# Altium project Bi_Directional_DC_DC.PrjPcb
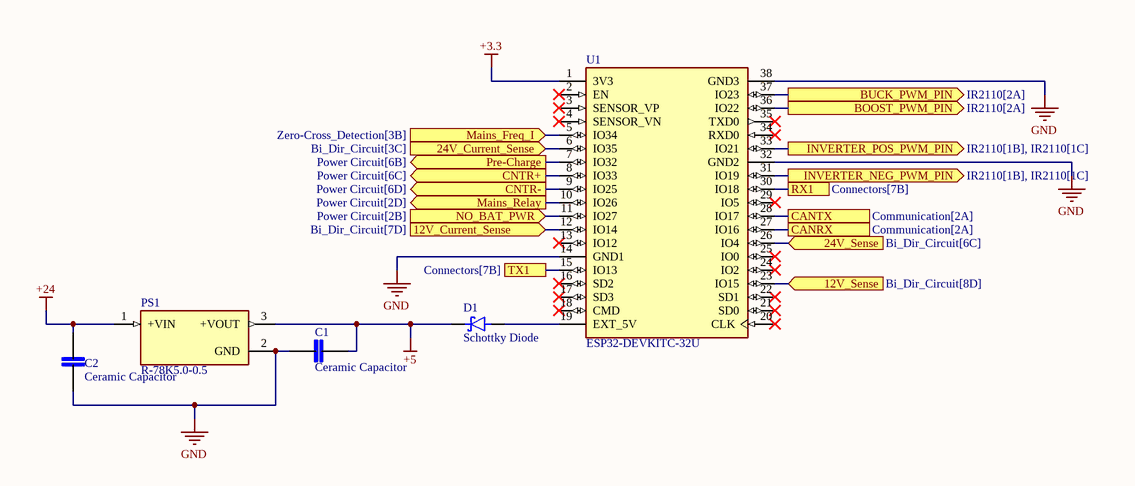
[diagram p0: ESP32.SchDoc]
7 sheets, 172 parts. Net scope: flat (ports and power ports of the same name join across sheets).
Board files: Bi_Dir.PcbDoc, Battery_Converter.PcbDoc
Sheets:
  ESP32.SchDoc
  IR2110.SchDoc
  Bi_Dir_Circuit.SchDoc
  Power Circuit.SchDoc
  Communication.SchDoc
  Zero-Cross_Detection.SchDoc
  Connectors.SchDoc

## Sheet ESP32.SchDoc
size 381 x 241 mm; SheetNumber: 1; SheetTotal: 7

### Parts
C1  Ceramic Capacitor  [Ceramic Capacitor]
C2  Ceramic Capacitor  [Ceramic Capacitor]
D1  Schottky Diode  [Common Trhough Hole]
PS1  R-78K5.0-0.5  [CONV_R-78K5.0-0.5]
U1  ESP32-DEVKITC-32U  [MODULE_ESP32-DEVKITC-32U]

### Ports
12V_Current_Sense (in, see Bi_Dir_Circuit[7D]), 12V_Sense (in, see Bi_Dir_Circuit[8D]), 24V_Current_Sense (in, see Bi_Dir_Circuit[3C]), 24V_Sense (in, see Bi_Dir_Circuit[6C]), BOOST_PWM_PIN (out, see IR2110[2A]), BUCK_PWM_PIN (out, see IR2110[2A]), CANRX (see Communication[2A]), CANTX (see Communication[2A]), CNTR+ (out, see Power Circuit[6C]), CNTR- (out, see Power Circuit[6D]), INVERTER_NEG_PWM_PIN (out, see IR2110[1B], IR2110[1C]), INVERTER_POS_PWM_PIN (out, see IR2110[1B], IR2110[1C]), Mains_Freq_I (in, see Zero-Cross_Detection[3B]), Mains_Relay (out, see Power Circuit[2D]), NO_BAT_PWR (in, see Power Circuit[2B]), Pre-Charge (out, see Power Circuit[6B]), RX1 (see Connectors[7B]), TX1 (see Connectors[7B])

### Nets
+3.3: U1.1(3V3)
+5: C1.2 D1.1(K) PS1.3(+VOUT)
+24: C2.2 PS1.1(+VIN)
GND: C1.1 C2.1 PS1.2(GND) U1.14(GND1) U1.32(GND2) U1.38(GND3)
NetC18_P: U1.26(IO4) ; port 24V_Sense
NetC20_P: U1.6(IO35) ; port 24V_Current_Sense
NetC24_P: U1.23(IO15) ; port 12V_Sense
NetC25_P: U1.12(IO14) ; port 12V_Current_Sense
NetD1_2: D1.2(A) U1.19(EXT_5V)
NetJ6_2: U1.30(IO18) ; port RX1
NetJ6_3: U1.15(IO13) ; port TX1
NetR35_2: U1.7(IO32) ; port Pre-Charge
NetR37_2: U1.11(IO27) ; port NO_BAT_PWR
NetR40_2: U1.8(IO33) ; port CNTR+
NetR42_2: U1.10(IO26) ; port Mains_Relay
NetR43_2: U1.9(IO25) ; port CNTR-
NetR46_1: U1.5(IO34) ; port Mains_Freq_I
NetU1_27: U1.27(IO16) ; port CANRX
NetU1_28: U1.28(IO17) ; port CANTX
NetU1_31: U1.31(IO19) ; port INVERTER_NEG_PWM_PIN
NetU1_33: U1.33(IO21) ; port INVERTER_POS_PWM_PIN
NetU1_36: U1.36(IO22) ; port BOOST_PWM_PIN
NetU1_37: U1.37(IO23) ; port BUCK_PWM_PIN

Not connected (* = marked no-connect by the designer): U1 2(EN)* 3(SENSOR_VP)* 4(SENSOR_VN)* 13(IO12)* 16(SD2)* 17(SD3)* 18(CMD)* 20(CLK)* 21(SD0)* 22(SD1)* 24(IO2)* 25(IO0)* 29(IO5)* 34(RXD0)* 35(TXD0)*

### Library data of the parts
C1 C2 = Ceramic Capacitor: MP: LD051A121KAB2A; MF: AVX; SnapEDA_Link: https://www.snapeda.com/parts/LD051A121KAB2A/AVX/view-part/?ref=snap; Package: 0805 AVX; Check_prices: https://www.snapeda.com/parts/LD051A121KAB2A/AVX/view-part/?ref=eda; Purchase-URL: https://pricing.snapeda.com/search/part/LD051A121KAB2A/?ref=eda; Price: None; Value: *; Availability: In Stock
D1 = Schottky Diode: MF: Diodes Inc.; MP: 1N5817-T; Package: DO-41 Diodes Inc.; Price: None; Check_prices: https://www.snapeda.com/parts/1N5817-T/Diodes+Inc./view-part/?ref=eda; Value: *; SnapEDA_Link: https://www.snapeda.com/parts/1N5817-T/Diodes+Inc./view-part/?ref=snap; Availability: In Stock; Purchase-URL: https://pricing.snapeda.com/search/part/1N5817-T/?ref=eda
PS1 = R-78K5.0-0.5: 0.5A DC/DC-Converter 'INNOLINE' SIP3 reg; MF: Recom Power; Package: None; Value: *; Check_prices: https://www.snapeda.com/parts/R-78K5.0-0.5/Recom+Power/view-part/?ref=eda; Purchase-URL: https://pricing.snapeda.com/search/part/R-78K5.0-0.5/?ref=eda; Availability: In Stock; SnapEDA_Link: https://www.snapeda.com/parts/R-78K5.0-0.5/Recom+Power/view-part/?ref=snap; Price: None; MP: R-78K5.0-0.5
U1 = ESP32-DEVKITC-32U: ESP32-WROOM-32UE series Transceiver; 802.11 b/g/n (Wi-Fi, WiFi, WLAN), BluetoothÂ® Smart Ready 4.x Dual Mode Evaluation Board; MF: Espressif Systems; SnapEDA_Link: https://www.snapeda.com/parts/ESP32-DEVKITC-32U/Espressif+Systems/view-part/?ref=snap; Availability: In Stock; Purchase-URL: https://pricing.snapeda.com/search/part/ESP32-DEVKITC-32U/?ref=eda; Check_prices: https://www.snapeda.com/parts/ESP32-DEVKITC-32U/Espressif+Systems/view-part/?ref=eda; Value: *; Package: None; MP: ESP32-DEVKITC-32U; Price: None

## Sheet IR2110.SchDoc
size A3; SheetNumber: 2; SheetTotal: 7
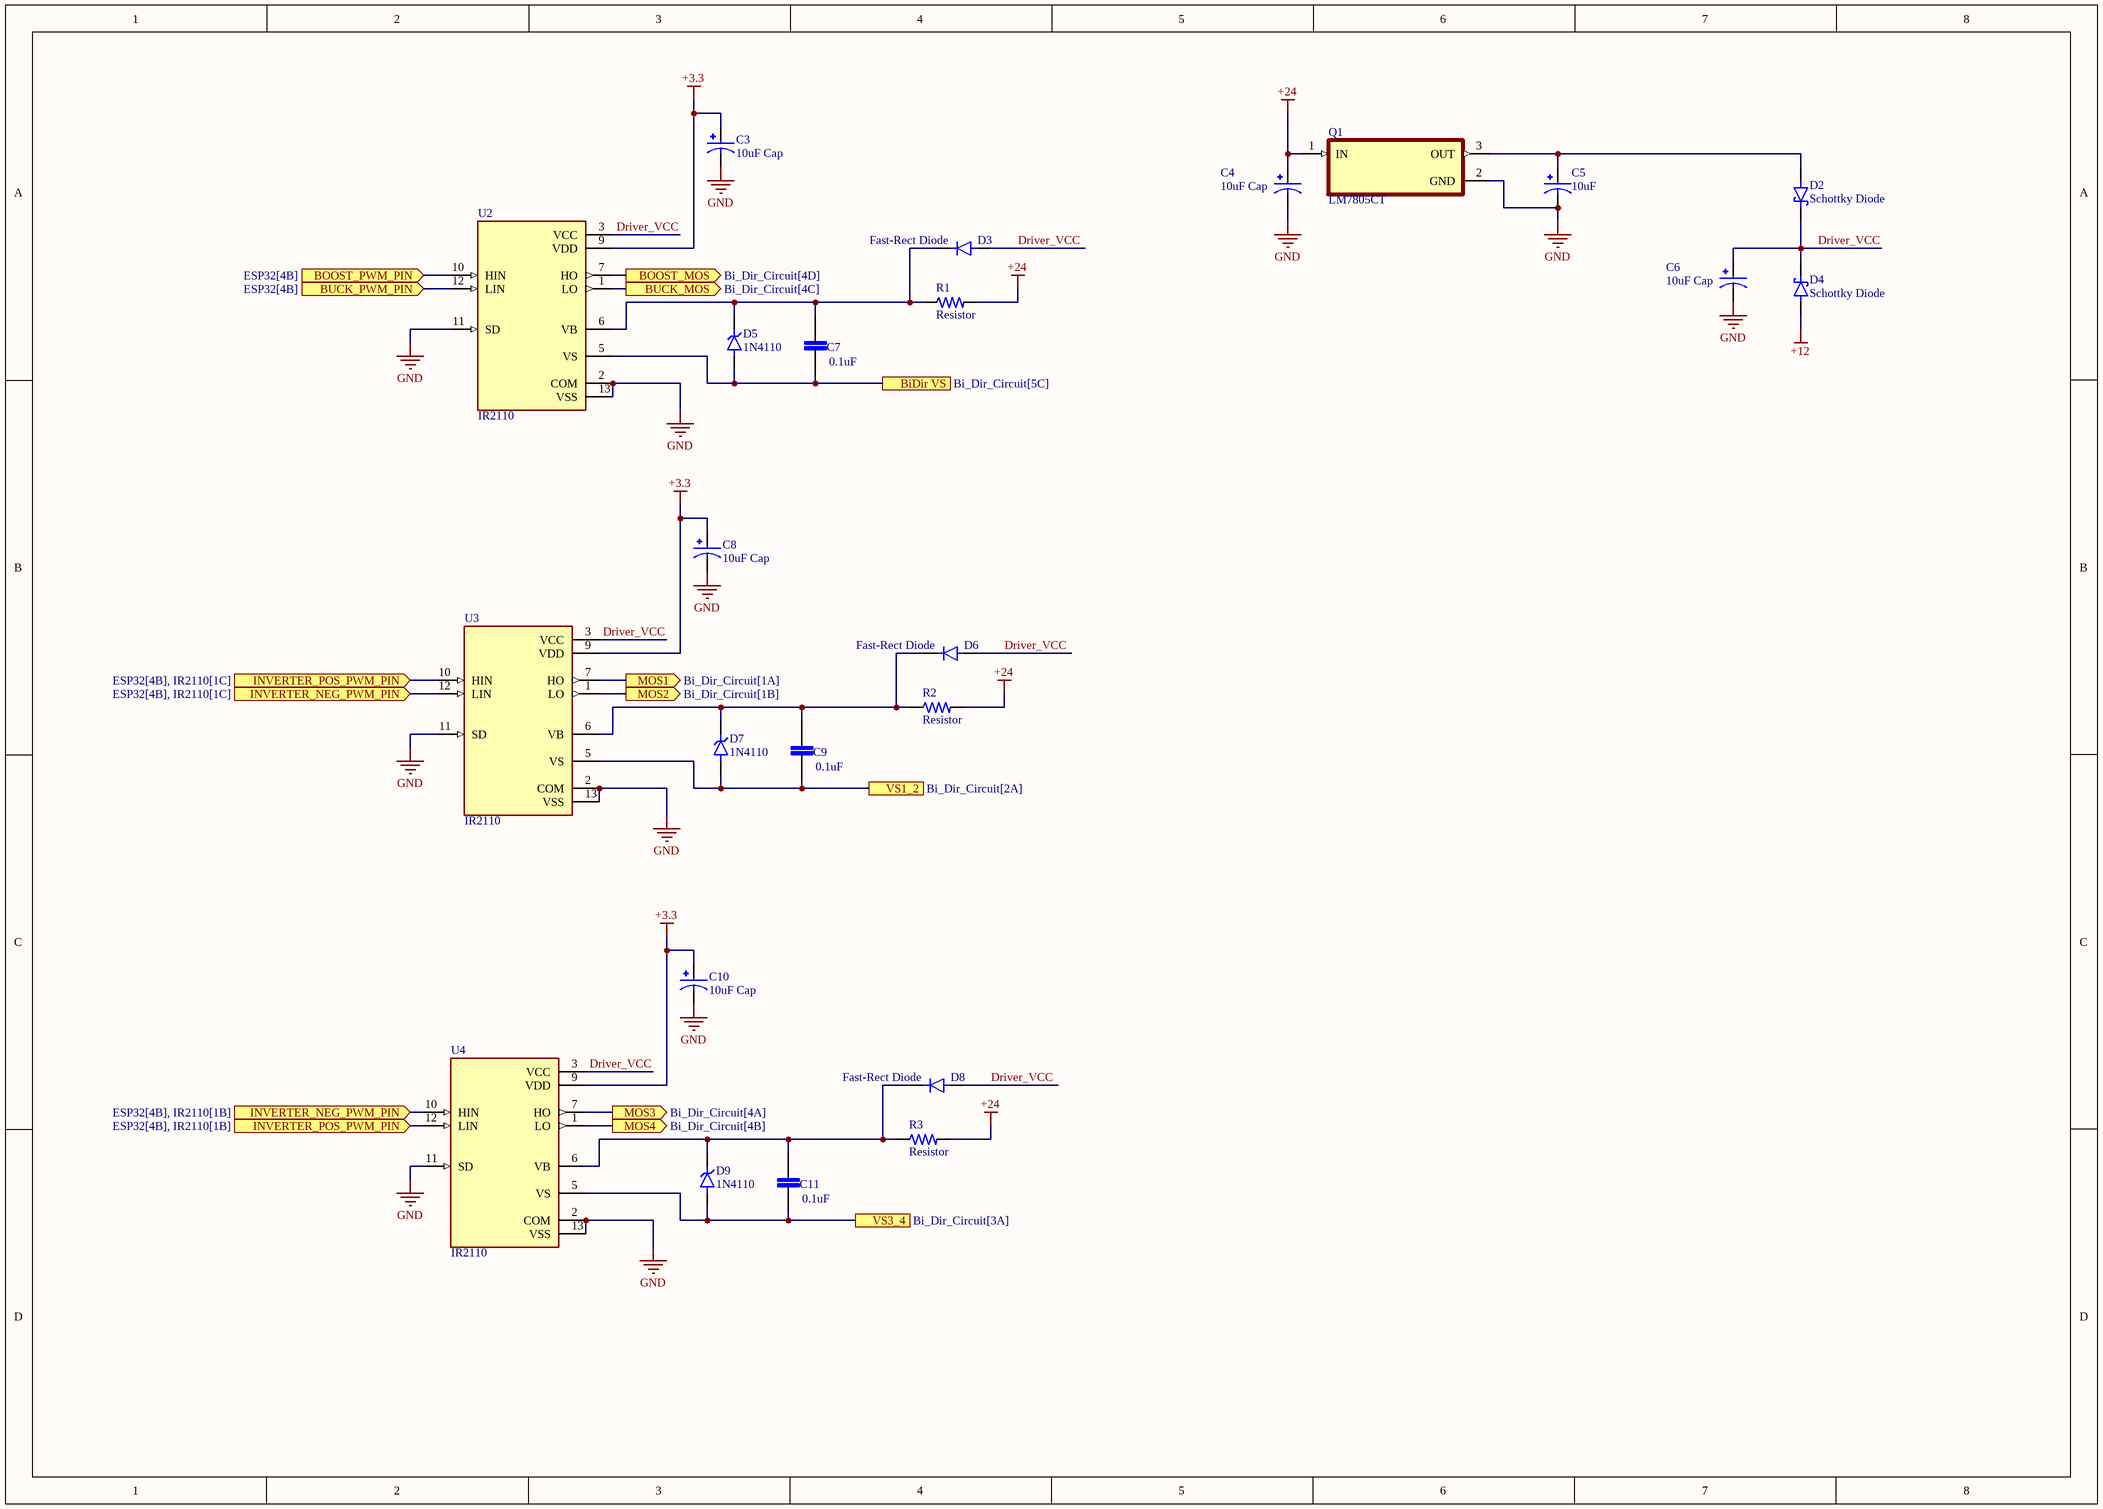
[diagram p1: IR2110.SchDoc]

### Parts
C3  10uF Cap  [CAP_10uF]
C4  10uF Cap  [CAP_10uF]
C5  10uF  [CAP_10uF]
C6  10uF Cap  [CAP_10uF]
C7  0.1uF  [Ceramic Capacitor]
C8  10uF Cap  [CAP_10uF]
C9  0.1uF  [Ceramic Capacitor]
C10  10uF Cap  [CAP_10uF]
C11  0.1uF  [Ceramic Capacitor]
D2  Schottky Diode  [Common Trhough Hole]
D3  Fast-Rect Diode  [Common Trhough Hole]
D4  Schottky Diode  [Common Trhough Hole]
D5  1N4110  [Common Trhough Hole]
D6  Fast-Rect Diode  [Common Trhough Hole]
D7  1N4110  [Common Trhough Hole]
D8  Fast-Rect Diode  [Common Trhough Hole]
D9  1N4110  [Common Trhough Hole]
Q1  LM7805CT  [LM7805CT]
R1  Resistor  [Resistor_Through Hole]
R2  Resistor  [Resistor_Through Hole]
R3  Resistor  [Resistor_Through Hole]
U2  IR2110  [IR2110]
U3  IR2110  [IR2110]
U4  IR2110  [IR2110]

### Ports
BiDir VS (see Bi_Dir_Circuit[5C]), BOOST_MOS (out, see Bi_Dir_Circuit[4D]), BOOST_PWM_PIN (in, see ESP32[4B]), BUCK_MOS (out, see Bi_Dir_Circuit[4C]), BUCK_PWM_PIN (in, see ESP32[4B]), INVERTER_NEG_PWM_PIN (in, see ESP32[4B], IR2110[1B]), INVERTER_NEG_PWM_PIN (in, see ESP32[4B], IR2110[1C]), INVERTER_POS_PWM_PIN (in, see ESP32[4B], IR2110[1B]), INVERTER_POS_PWM_PIN (in, see ESP32[4B], IR2110[1C]), MOS1 (out, see Bi_Dir_Circuit[1A]), MOS2 (out, see Bi_Dir_Circuit[1B]), MOS3 (out, see Bi_Dir_Circuit[4A]), MOS4 (out, see Bi_Dir_Circuit[4B]), VS1_2 (see Bi_Dir_Circuit[2A]), VS3_4 (see Bi_Dir_Circuit[3A])

### Nets
+3.3: C3.P C8.P C10.P U2.9(VDD) U3.9(VDD) U4.9(VDD)
+12: D4.2(A)
+24: C4.P Q1.1(IN) R1.2 R2.2 R3.2
GND: C3.N C4.N C5.N C6.N C8.N C10.N Q1.2(GND) U2.2(COM) U2.11(SD) U2.13(VSS) U3.2(COM) U3.11(SD) U3.13(VSS) U4.2(COM) U4.11(SD) U4.13(VSS)
Driver_VCC: C6.P D2.1(K) D3.2(A) D4.1(K) D6.2(A) D8.2(A) U2.3(VCC) U3.3(VCC) U4.3(VCC)
NetC5_P: C5.P D2.2(A) Q1.3(OUT)
NetC7_1: C7.1 D5.2(A) U2.5(VS) ; port BiDir VS
NetC7_2: C7.2 D3.1(K) D5.1(K) R1.1 U2.6(VB)
NetC9_1: C9.1 D7.2(A) U3.5(VS) ; port VS1_2
NetC9_2: C9.2 D6.1(K) D7.1(K) R2.1 U3.6(VB)
NetC11_1: C11.1 D9.2(A) U4.5(VS) ; port VS3_4
NetC11_2: C11.2 D8.1(K) D9.1(K) R3.1 U4.6(VB)
NetD14_C: U3.7(HO) ; port MOS1
NetD15_C: U4.7(HO) ; port MOS3
NetD17_C: U3.1(LO) ; port MOS2
NetD18_C: U4.1(LO) ; port MOS4
NetD24_C: U2.1(LO) ; port BUCK_MOS
NetD25_C: U2.7(HO) ; port BOOST_MOS
NetU1_31: U3.12(LIN) U4.10(HIN) ; port INVERTER_NEG_PWM_PIN
NetU1_33: U3.10(HIN) U4.12(LIN) ; port INVERTER_POS_PWM_PIN
NetU1_36: U2.10(HIN) ; port BOOST_PWM_PIN
NetU1_37: U2.12(LIN) ; port BUCK_PWM_PIN

### Library data of the parts
C3-C6 C8 C10 = 10uF Cap: CAP ALUM 10UF 20% 50V RADIAL; MP: ECE-A1HN100UI; MF: Panasonic; SnapEDA_Link: https://www.snapeda.com/parts/ECE-A1HN100UI/Panasonic/view-part/2321690/?ref=snap; Price: None; Check_prices: https://www.snapeda.com/parts/ECE-A1HN100UI/Panasonic/view-part/2321690/?ref=eda; Value: *; Availability: In Stock; Package: RADIAL-2 Panasonic
C7 C9 C11 = Ceramic Capacitor: MP: LD051A121KAB2A; MF: AVX; SnapEDA_Link: https://www.snapeda.com/parts/LD051A121KAB2A/AVX/view-part/?ref=snap; Package: 0805 AVX; Check_prices: https://www.snapeda.com/parts/LD051A121KAB2A/AVX/view-part/?ref=eda; Purchase-URL: https://pricing.snapeda.com/search/part/LD051A121KAB2A/?ref=eda; Price: None; Value: *; Availability: In Stock
D2 D4 = Schottky Diode: MF: Diodes Inc.; MP: 1N5817-T; Package: DO-41 Diodes Inc.; Price: None; Check_prices: https://www.snapeda.com/parts/1N5817-T/Diodes+Inc./view-part/?ref=eda; Value: *; SnapEDA_Link: https://www.snapeda.com/parts/1N5817-T/Diodes+Inc./view-part/?ref=snap; Availability: In Stock; Purchase-URL: https://pricing.snapeda.com/search/part/1N5817-T/?ref=eda
D3 D6 D8 = Normal Diode: MF: NTE Electronics, Inc.; MP: 1N4007; Package: DO-41 NTE Electronics; Check_prices: https://www.snapeda.com/parts/1N4007/NTE+Electronics/view-part/?ref=eda; Value: *; Purchase-URL: https://pricing.snapeda.com/search/part/1N4007/?ref=eda; Availability: In Stock; SnapEDA_Link: https://www.snapeda.com/parts/1N4007/NTE+Electronics/view-part/?ref=snap; Price: None
D5 D7 D9 = Zener Diode: MP: 1SMA5926; MF: Taiwan Semiconductor; Package: SMA-2 Taiwan Semiconductor; Availability: In Stock; Purchase-URL: https://pricing.snapeda.com/search/part/1SMA5926/?ref=eda; SnapEDA_Link: https://www.snapeda.com/parts/1SMA5926/Taiwan+Semiconductor/view-part/?ref=snap; Price: None; Check_prices: https://www.snapeda.com/parts/1SMA5926/Taiwan+Semiconductor/view-part/?ref=eda; Value: *
Q1 = LM7805CT: MP: LM7805CT/NOPB; Price: None; Availability: Unavailable; Value: *; Package: None
R1-R3 = Resistor: Power_Rating: .25 W; MP: 2-2176053-0; Tolerance: 1%; Resistance: .33; MF: TE Connectivity; Price: None; Availability: In Stock; EU_RoHS_Compliance: Compliant with Exemptions; Package: 0805; Value: *; SnapEDA_Link: https://www.snapeda.com/parts/2-2176053-0/TE+Connectivity/view-part/?ref=snap; Check_prices: https://www.snapeda.com/parts/2-2176053-0/TE+Connectivity/view-part/?ref=eda
U2-U4 = IR2110: Half-Bridge Gate Driver IC Non-Inverting 16-SOIC; MF: Infineon; Package: SOIC-16 International Rectifier; Purchase-URL: https://pricing.snapeda.com/search/part/IR2110/?ref=eda; Value: *; SnapEDA_Link: https://www.snapeda.com/parts/IR2110/Infineon+Technologies/view-part/?ref=snap; Price: None; MP: IR2110; Check_prices: https://www.snapeda.com/parts/IR2110/Infineon+Technologies/view-part/?ref=eda; Availability: In Stock

## Sheet Bi_Dir_Circuit.SchDoc
size A2; SheetNumber: 3; SheetTotal: 7
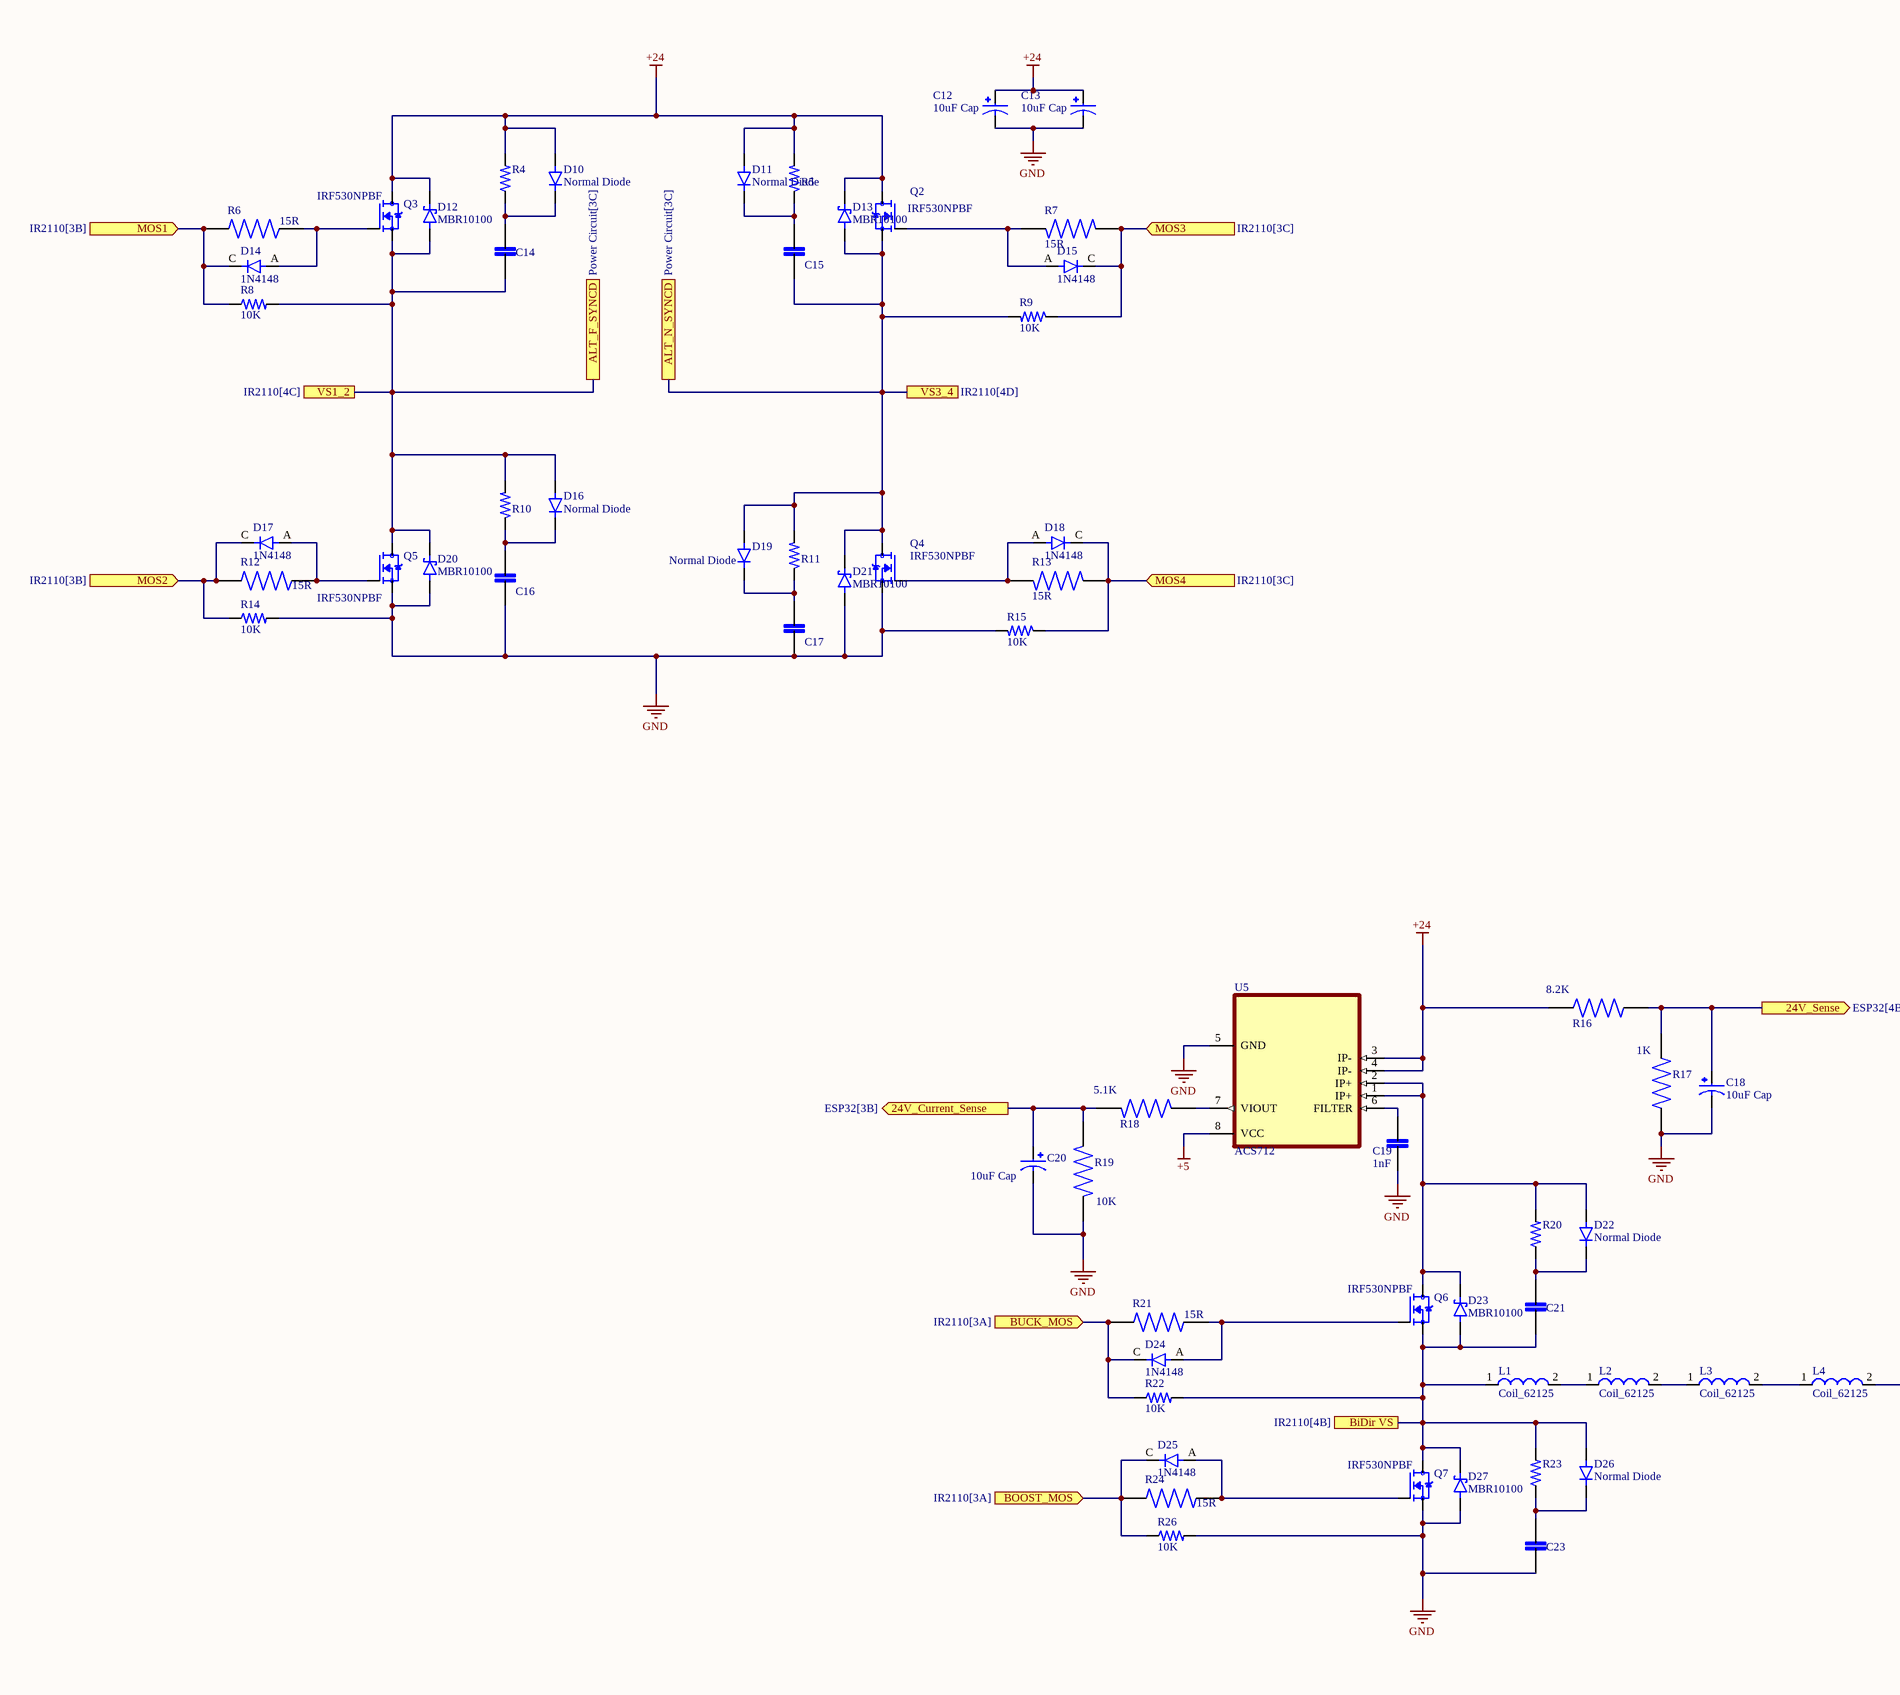
[diagram p2: Bi_Dir_Circuit.SchDoc, left]
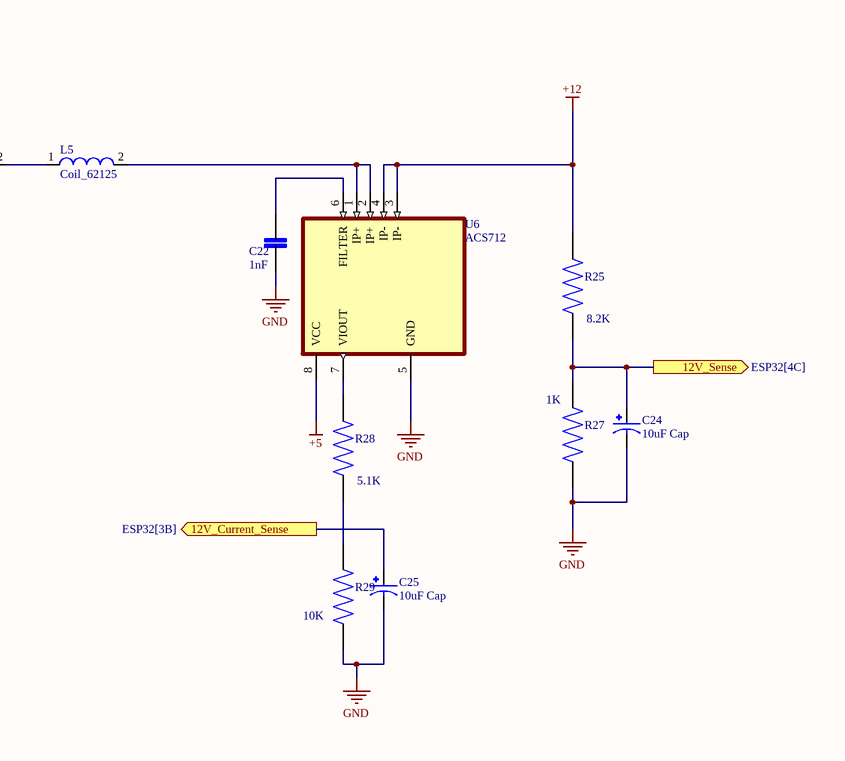
[diagram p3: Bi_Dir_Circuit.SchDoc, right]

### Parts
C12  10uF Cap  [2200uF_Cap]
C13  10uF Cap  [2200uF_Cap]
C14  Ceramic Capacitor  [Ceramic Capacitor]  (value not drawn)
C15  Ceramic Capacitor  [Ceramic Capacitor]  (value not drawn)
C16  Ceramic Capacitor  [Ceramic Capacitor]  (value not drawn)
C17  Ceramic Capacitor  [Ceramic Capacitor]  (value not drawn)
C18  10uF Cap  [CAP_10uF]
C19  1nF  [Ceramic Capacitor]
C20  10uF Cap  [CAP_10uF]
C21  Ceramic Capacitor  [Ceramic Capacitor]  (value not drawn)
C22  1nF  [Ceramic Capacitor]
C23  Ceramic Capacitor  [Ceramic Capacitor]  (value not drawn)
C24  10uF Cap  [CAP_10uF]
C25  10uF Cap  [CAP_10uF]
D10  Normal Diode  [Common Trhough Hole]
D11  Normal Diode  [Common Trhough Hole]
D12  MBR10100  [MBR10100]
D13  MBR10100  [MBR10100]
D14  1N4148  [1N4007 DIODE]
D15  1N4148  [1N4007 DIODE]
D16  Normal Diode  [Common Trhough Hole]
D17  1N4148  [1N4007 DIODE]
D18  1N4148  [1N4007 DIODE]
D19  Normal Diode  [Common Trhough Hole]
D20  MBR10100  [MBR10100]
D21  MBR10100  [MBR10100]
D22  Normal Diode  [Common Trhough Hole]
D23  MBR10100  [MBR10100]
D24  1N4148  [1N4007 DIODE]
D25  1N4148  [1N4007 DIODE]
D26  Normal Diode  [Common Trhough Hole]
D27  MBR10100  [MBR10100]
L1  Coil_62125  [Coil 65125]
L2  Coil_62125  [Coil 65125]
L3  Coil_62125  [Coil 65125]
L4  Coil_62125  [Coil 65125]
L5  Coil_62125  [Coil 65125]
Q2  IRF530NPBF  [IRF530N]
Q3  IRF530NPBF  [IRF530N]
Q4  IRF530NPBF  [IRF530N]
Q5  IRF530NPBF  [IRF530N]
Q6  IRF530NPBF  [IRF530N]
Q7  IRF530NPBF  [IRF530N]
R4  Resistor  [Resistor_Through Hole]  (value not drawn)
R5  Resistor  [Resistor_Through Hole]  (value not drawn)
R6  15R  [Resistor_Through Hole]
R7  15R  [Resistor_Through Hole]
R8  10K  [Resistor_Through Hole]
R9  10K  [Resistor_Through Hole]
R10  Resistor  [Resistor_Through Hole]  (value not drawn)
R11  Resistor  [Resistor_Through Hole]  (value not drawn)
R12  15R  [Resistor_Through Hole]
R13  15R  [Resistor_Through Hole]
R14  10K  [Resistor_Through Hole]
R15  10K  [Resistor_Through Hole]
R16  8.2K  [Resistor_Through Hole]
R17  1K  [Resistor_Through Hole]
R18  5.1K  [Resistor_Through Hole]
R19  10K  [Resistor_Through Hole]
R20  Resistor  [Resistor_Through Hole]  (value not drawn)
R21  15R  [Resistor_Through Hole]
R22  10K  [Resistor_Through Hole]
R23  Resistor  [Resistor_Through Hole]  (value not drawn)
R24  15R  [Resistor_Through Hole]
R25  8.2K  [Resistor_Through Hole]
R26  10K  [Resistor_Through Hole]
R27  1K  [Resistor_Through Hole]
R28  5.1K  [Resistor_Through Hole]
R29  10K  [Resistor_Through Hole]
U5  ACS712  [ACS712]
U6  ACS712  [ACS712]

### Ports
12V_Current_Sense (out, see ESP32[3B]), 12V_Sense (out, see ESP32[4C]), 24V_Current_Sense (out, see ESP32[3B]), 24V_Sense (out, see ESP32[4B]), ALT_F_SYNCD (see Power Circuit[3C]), ALT_N_SYNCD (see Power Circuit[3C]), BiDir VS (see IR2110[4B]), BOOST_MOS (in, see IR2110[3A]), BUCK_MOS (in, see IR2110[3A]), MOS1 (in, see IR2110[3B]), MOS2 (in, see IR2110[3B]), MOS3 (in, see IR2110[3C]), MOS4 (in, see IR2110[3C]), VS1_2 (see IR2110[4C]), VS3_4 (see IR2110[4D])

### Nets
+5: U5.8(VCC) U6.8(VCC)
+12: R25.2 U6.3(IP-) U6.4(IP-)
+24: C12.P C13.P D10.2(A) D11.2(A) D12.1(K) D13.1(K) Q2.2(D) Q3.2(D) R4.2 R5.2 R16.1 U5.3(IP-) U5.4(IP-)
GND: C12.N C13.N C16.1 C17.1 C18.N C19.1 C20.N C22.1 C23.1 C24.N C25.N D20.3(A) D21.3(A) D27.3(A) Q4.3(S) Q5.3(S) Q7.3(S) R14.2 R15.2 R17.1 R19.1 R26.2 R27.1 R29.1 U5.5(GND) U6.5(GND)
NetC7_1: C21.1 D23.3(A) D26.2(A) D27.1(K) L1.1 Q6.3(S) Q7.2(D) R22.2 R23.2 ; port BiDir VS
NetC9_1: C14.1 D12.3(A) D16.2(A) D20.1(K) Q3.3(S) Q5.2(D) R8.2 R10.2 ; port VS1_2, port ALT_F_SYNCD
NetC11_1: C15.1 D13.3(A) D19.2(A) D21.1(K) Q2.3(S) Q4.2(D) R9.2 R11.2 ; port VS3_4, port ALT_N_SYNCD
NetC14_2: C14.2 D10.1(K) R4.1
NetC15_2: C15.2 D11.1(K) R5.1
NetC16_2: C16.2 D16.1(K) R10.1
NetC17_2: C17.2 D19.1(K) R11.1
NetC18_P: C18.P R16.2 R17.2 ; port 24V_Sense
NetC19_2: C19.2 U5.6(FILTER)
NetC20_P: C20.P R18.1 R19.2 ; port 24V_Current_Sense
NetC21_2: C21.2 D22.1(K) R20.1
NetC22_2: C22.2 U6.6(FILTER)
NetC23_2: C23.2 D26.1(K) R23.1
NetC24_P: C24.P R25.1 R27.2 ; port 12V_Sense
NetC25_P: C25.P ; port 12V_Current_Sense
NetD14_A: D14.A Q3.1(G) R6.2
NetD14_C: D14.C R6.1 R8.1 ; port MOS1
NetD15_A: D15.A Q2.1(G) R7.2
NetD15_C: D15.C R7.1 R9.1 ; port MOS3
NetD17_A: D17.A Q5.1(G) R12.2
NetD17_C: D17.C R12.1 R14.1 ; port MOS2
NetD18_A: D18.A Q4.1(G) R13.2
NetD18_C: D18.C R13.1 R15.1 ; port MOS4
NetD22_2: D22.2(A) D23.1(K) Q6.2(D) R20.2 U5.1(IP+) U5.2(IP+)
NetD24_A: D24.A Q6.1(G) R21.2
NetD24_C: D24.C R21.1 R22.1 ; port BUCK_MOS
NetD25_A: D25.A Q7.1(G) R24.2
NetD25_C: D25.C R24.1 R26.1 ; port BOOST_MOS
NetL1_2: L1.2 L2.1
NetL2_2: L2.2 L3.1
NetL3_2: L3.2 L4.1
NetL4_2: L4.2 L5.1
NetL5_2: L5.2 U6.1(IP+) U6.2(IP+)
NetR18_2: R18.2 U5.7(VIOUT)
NetR28_1: R28.1 R29.2
NetR28_2: R28.2 U6.7(VIOUT)

### Library data of the parts
C12 C13 C18 C20 C24 C25 = 10uF Cap: as C3 on sheet IR2110; SnapEDA_Link: https://www.snapeda.com/parts/ECE-A1HN100UI/Panasonic/view-part/2321690/?ref=snap; Price: None; Check_prices: https://www.snapeda.com/parts/ECE-A1HN100UI/Panasonic/view-part/2321690/?ref=eda; Value: *; Availability: In Stock; Package: RADIAL-2 Panasonic
C14-C17 C19 C21-C23 = Ceramic Capacitor: MP: LD051A121KAB2A; MF: AVX; SnapEDA_Link: https://www.snapeda.com/parts/LD051A121KAB2A/AVX/view-part/?ref=snap; Package: 0805 AVX; Check_prices: https://www.snapeda.com/parts/LD051A121KAB2A/AVX/view-part/?ref=eda; Purchase-URL: https://pricing.snapeda.com/search/part/LD051A121KAB2A/?ref=eda; Price: None; Value: *; Availability: In Stock
D10 D11 D16 D19 D22 D26 = Normal Diode: MF: NTE Electronics, Inc.; MP: 1N4007; Package: DO-41 NTE Electronics; Check_prices: https://www.snapeda.com/parts/1N4007/NTE+Electronics/view-part/?ref=eda; Value: *; Purchase-URL: https://pricing.snapeda.com/search/part/1N4007/?ref=eda; Availability: In Stock; SnapEDA_Link: https://www.snapeda.com/parts/1N4007/NTE+Electronics/view-part/?ref=snap; Price: None
D12 D13 D20 D21 D23 D27 = MBR10100: MF: Diodes Inc.; MP: 1N5817-T; Package: DO-41 Diodes Inc.; Price: None; Check_prices: https://www.snapeda.com/parts/1N5817-T/Diodes+Inc./view-part/?ref=eda; Value: *; SnapEDA_Link: https://www.snapeda.com/parts/1N5817-T/Diodes+Inc./view-part/?ref=snap; Availability: In Stock; Purchase-URL: https://pricing.snapeda.com/search/part/1N5817-T/?ref=eda
D14 D15 D17 D18 D24 D25 = 1N4007: Diode Standard 1000 V 1A Through Hole DO-41; MF: NTE Electronics, Inc.; Package: DO-41 NTE Electronics; Check_prices: https://www.snapeda.com/parts/1N4007/NTE+Electronics/view-part/?ref=eda; Value: *; Purchase-URL: https://pricing.snapeda.com/search/part/1N4007/?ref=eda; Availability: In Stock; SnapEDA_Link: https://www.snapeda.com/parts/1N4007/NTE+Electronics/view-part/?ref=snap; MP: 1N4007; Price: None
L1-L5 = Coil_62125: Inductor Power Wirewound 470uH 10% 1KHz 25Q-Factor Ferrite 210mA 3.3Ohm DCR T/R; MF: Bourns; MP: SDR0604-471KL; Digi-Key_Part_Number: SDR0604-471KLCT-ND; Package: Nonstandard Bourns; Value: *; SnapEDA_Link: https://www.snapeda.com/parts/SDR0604-471KL/Bourns/view-part/567387/?ref=snap; Digi-Key_Purchase_URL: https://www.digikey.com/product-detail/en/bourns-inc/SDR0604-471KL/SDR0604-471KLCT-ND/2352941?utm_source=snapeda&utm_medium=aggregator&utm_campaign=symbol
Q2-Q7 = IRF530NPBF: RoHS Compliant | Low RDS(on) | Industry-leading quality | Dynamic dv/dt Rating | Fast Switching | Fully Avalanche Rated | 175C Operating Temperature; MF: Infineon Technologies; Purchase-URL: https://pricing.snapeda.com/search/part/IRF530NPBF/?ref=eda; Check_prices: https://www.snapeda.com/parts/IRF530NPBF/Infineon+Technologies/view-part/?ref=eda; SnapEDA_Link: https://www.snapeda.com/parts/IRF530NPBF/Infineon+Technologies/view-part/?ref=snap; Price: None; Availability: In Stock; Package: TO-220 Infineon; MP: IRF530NPBF; Value: *
R4 R5 R8-R11 R14 R15 R20 R22 R23 R26 = Resistor: as R1 on sheet IR2110; Price: None; Availability: In Stock; EU_RoHS_Compliance: Compliant with Exemptions; Package: 0805; Value: *; SnapEDA_Link: https://www.snapeda.com/parts/2-2176053-0/TE+Connectivity/view-part/?ref=snap; Check_prices: https://www.snapeda.com/parts/2-2176053-0/TE+Connectivity/view-part/?ref=eda
R6 R7 R12 R13 R16-R19 R21 R24 R25 R27-R29 = Resistor_Through Hole: 1.02 Ohms Â±1% 0.25W, 1/4W Through Hole Resistor Axial Metal Film; MP: MFR-25FTE52-1R; MF: Yageo; Availability: Warning; Value: *; Check_prices: https://www.snapeda.com/parts/MFR-25FTE52-1R/Yageo/view-part/4629919/?ref=eda; Package: Axial Yageo; Price: None; SnapEDA_Link: https://www.snapeda.com/parts/MFR-25FTE52-1R/Yageo/view-part/4629919/?ref=snap; Purchase-URL: https://pricing.snapeda.com/search/part/MFR-25FTE52-1R/?ref=eda
U5 U6 = ACS712: Current Sensor 5A 1 Channel Hall Effect, Open Loop Bidirectional 8-SOIC (0.154, 3.90mm Width); MP: ACS712ELCTR-05B-T; MF: Allegro MicroSystems LLC; SnapEDA_Link: https://www.snapeda.com/parts/ACS712ELCTR-05B-T/Allegro+MicroSystems+LLC/view-part/?ref=snap; Package: SOIC-8 Allegro MicroSystems LLC; Check_prices: https://www.snapeda.com/parts/ACS712ELCTR-05B-T/Allegro+MicroSystems+LLC/view-part/?ref=eda; Purchase-URL: https://pricing.snapeda.com/search/part/ACS712ELCTR-05B-T/?ref=eda; Price: None; Value: *; Availability: In Stock

## Sheet Power Circuit.SchDoc
size A3; SheetNumber: 4; SheetTotal: 7
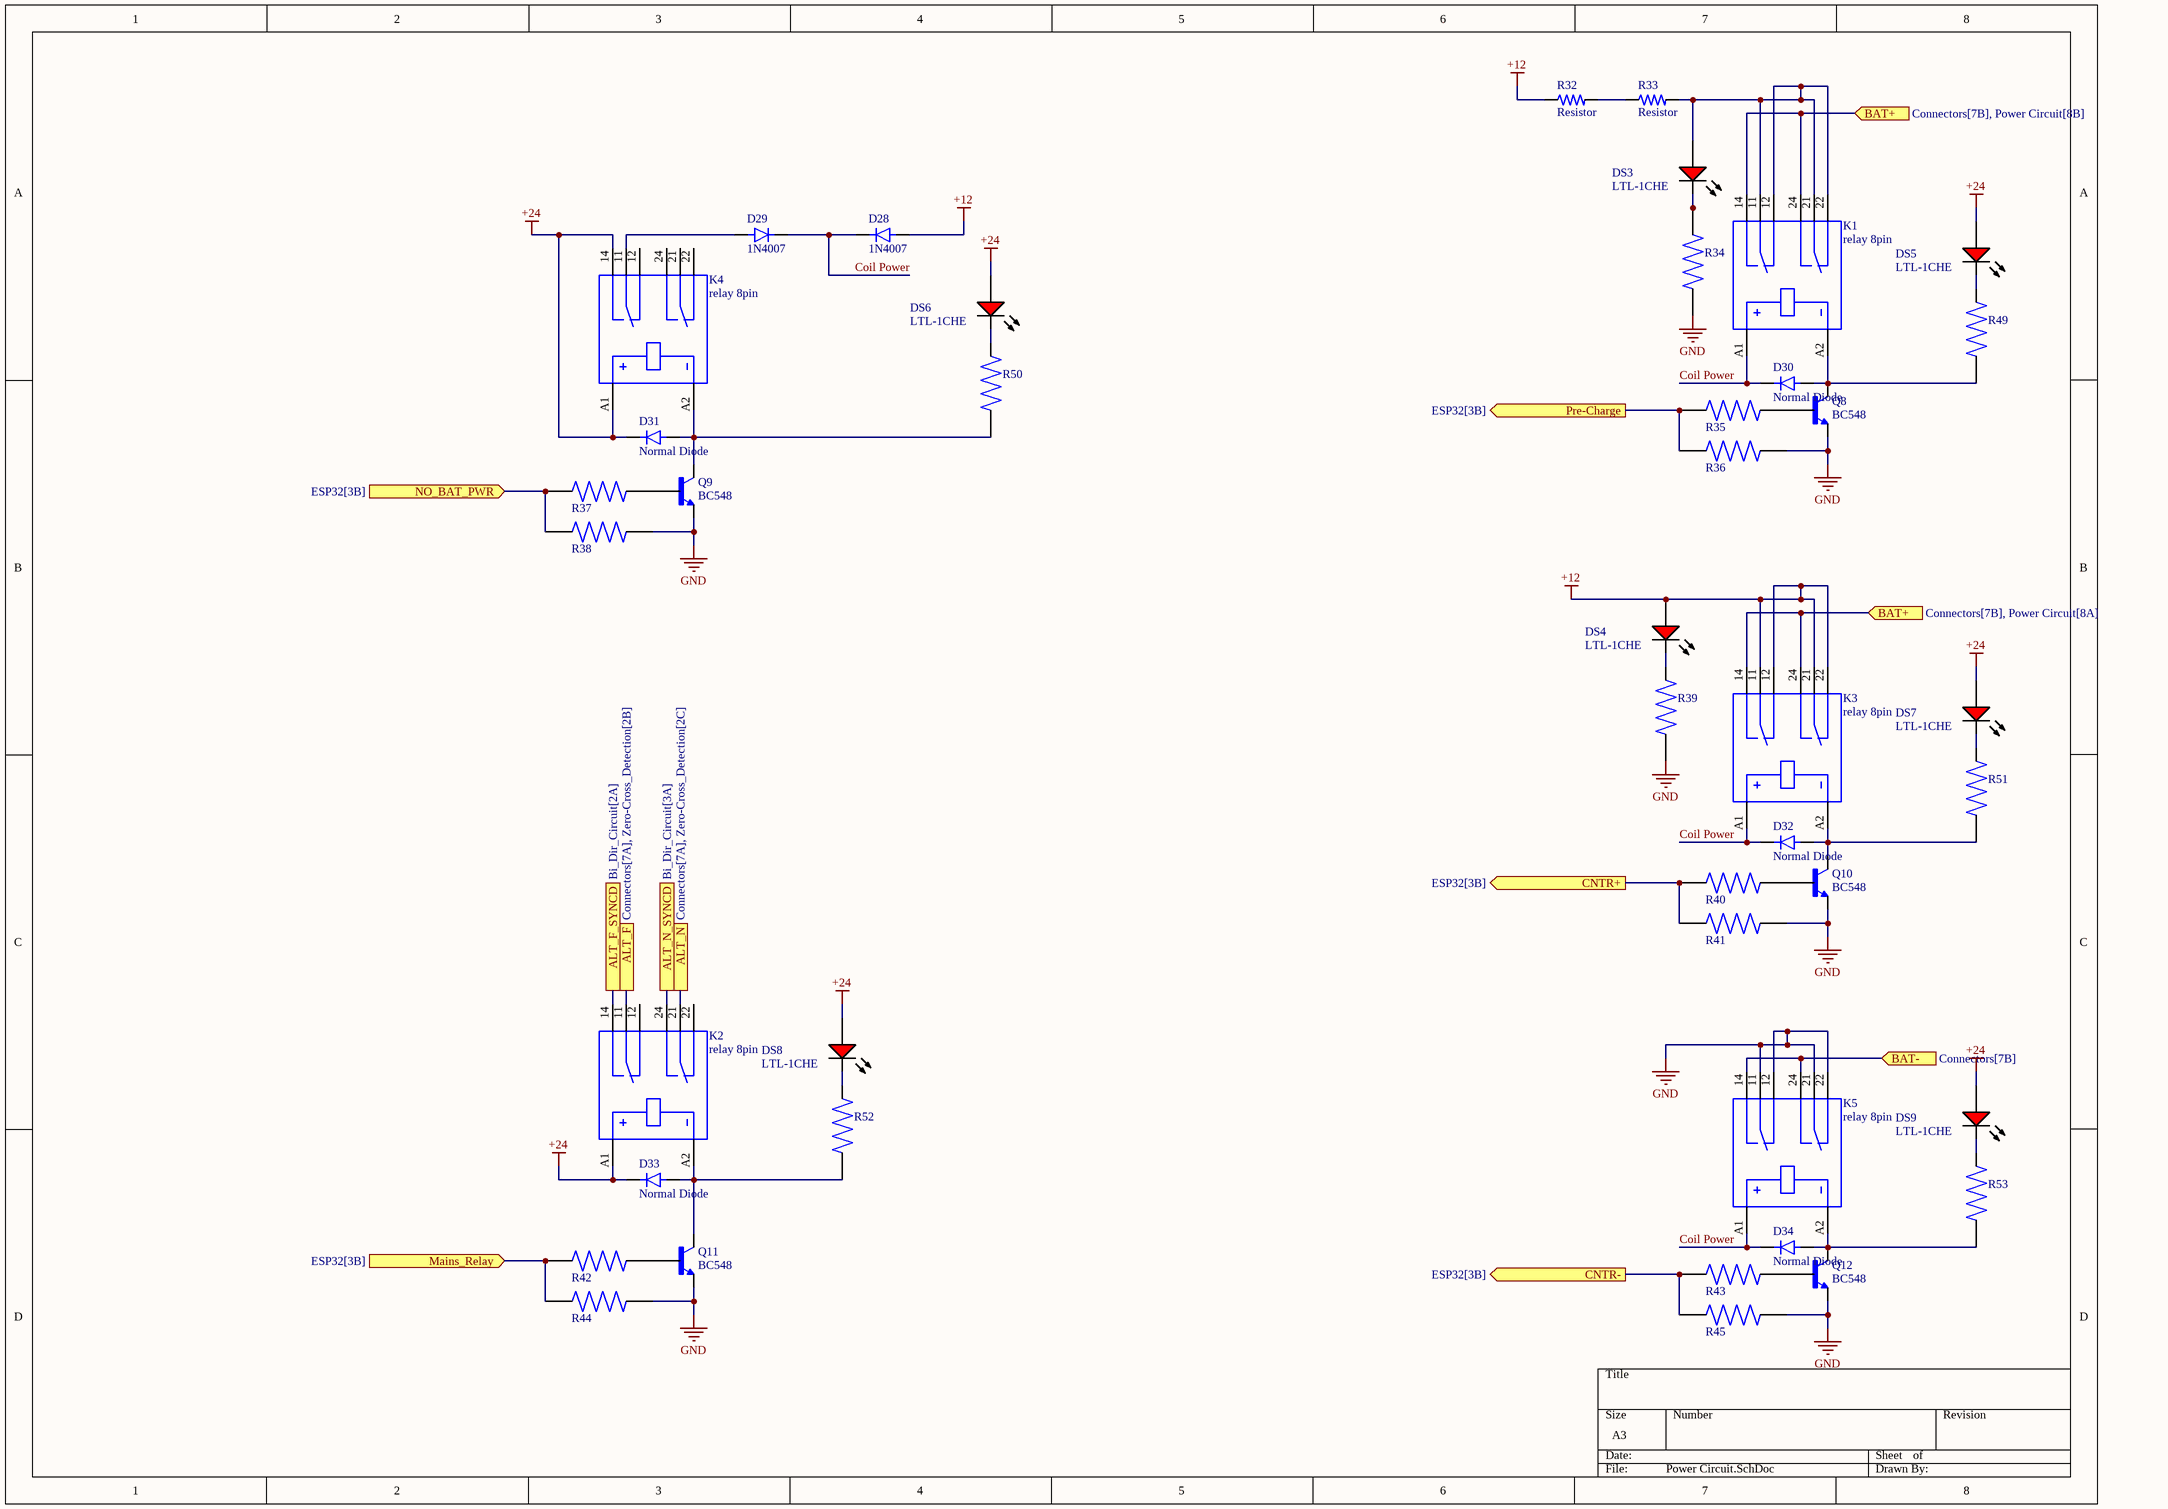
[diagram p4: Power Circuit.SchDoc]

### Parts
D28  1N4007  [Common Trhough Hole]
D29  1N4007  [Common Trhough Hole]
D30  Normal Diode  [Common Trhough Hole]
D31  Normal Diode  [Common Trhough Hole]
D32  Normal Diode  [Common Trhough Hole]
D33  Normal Diode  [Common Trhough Hole]
D34  Normal Diode  [Common Trhough Hole]
DS3  LTL-1CHE  [LED3mm]
DS4  LTL-1CHE  [LED3mm]
DS5  LTL-1CHE  [LED3mm]
DS6  LTL-1CHE  [LED3mm]
DS7  LTL-1CHE  [LED3mm]
DS8  LTL-1CHE  [LED3mm]
DS9  LTL-1CHE  [LED3mm]
K1  relay 8pin  [Relay socket 8pin]
K2  relay 8pin  [Relay socket 8pin]
K3  relay 8pin  [Relay socket 8pin]
K4  relay 8pin  [Relay socket 8pin]
K5  relay 8pin  [Relay socket 8pin]
Q8  BC548  [bc548]
Q9  BC548  [bc548]
Q10  BC548  [bc548]
Q11  BC548  [bc548]
Q12  BC548  [bc548]
R32  Resistor  [Resistor_Through Hole]
R33  Resistor  [Resistor_Through Hole]
R34  Resistor_Through Hole  [Resistor_Through Hole]  (value not drawn)
R35  Resistor_Through Hole  [Resistor_Through Hole]  (value not drawn)
R36  Resistor_Through Hole  [Resistor_Through Hole]  (value not drawn)
R37  Resistor_Through Hole  [Resistor_Through Hole]  (value not drawn)
R38  Resistor_Through Hole  [Resistor_Through Hole]  (value not drawn)
R39  Resistor_Through Hole  [Resistor_Through Hole]  (value not drawn)
R40  Resistor_Through Hole  [Resistor_Through Hole]  (value not drawn)
R41  Resistor_Through Hole  [Resistor_Through Hole]  (value not drawn)
R42  Resistor_Through Hole  [Resistor_Through Hole]  (value not drawn)
R43  Resistor_Through Hole  [Resistor_Through Hole]  (value not drawn)
R44  Resistor_Through Hole  [Resistor_Through Hole]  (value not drawn)
R45  Resistor_Through Hole  [Resistor_Through Hole]  (value not drawn)
R49  Resistor_Through Hole  [Resistor_Through Hole]  (value not drawn)
R50  Resistor_Through Hole  [Resistor_Through Hole]  (value not drawn)
R51  Resistor_Through Hole  [Resistor_Through Hole]  (value not drawn)
R52  Resistor_Through Hole  [Resistor_Through Hole]  (value not drawn)
R53  Resistor_Through Hole  [Resistor_Through Hole]  (value not drawn)

### Ports
ALT_F (see Connectors[7A], Zero-Cross_Detection[2B]), ALT_F_SYNCD (see Bi_Dir_Circuit[2A]), ALT_N (see Connectors[7A], Zero-Cross_Detection[2C]), ALT_N_SYNCD (see Bi_Dir_Circuit[3A]), BAT+ (in, see Connectors[7B], Power Circuit[8A]), BAT+ (in, see Connectors[7B], Power Circuit[8B]), BAT- (in, see Connectors[7B]), CNTR+ (out, see ESP32[3B]), CNTR- (out, see ESP32[3B]), Mains_Relay (in, see ESP32[3B]), NO_BAT_PWR (in, see ESP32[3B]), Pre-Charge (out, see ESP32[3B])

### Nets
+12: D28.2(A) DS4.1(A) K3.11 K3.12 K3.21 K3.22 R32.1
+24: D31.1(K) D33.1(K) DS5.1(A) DS6.1(A) DS7.1(A) DS8.1(A) DS9.1(A) K2.A1 K4.14 K4.A1
GND: K5.11 K5.12 K5.21 K5.22 Q8.3(E) Q9.3(E) Q10.3(E) Q11.3(E) Q12.3(E) R34.2 R36.1 R38.1 R39.2 R41.1 R44.1 R45.1
Coil Power: D28.1(K) D29.1(K) D30.1(K) D32.1(K) D34.1(K) K1.A1 K3.A1 K5.A1
NetC9_1: K2.14 ; port ALT_F_SYNCD
NetC11_1: K2.24 ; port ALT_N_SYNCD
NetD29_2: D29.2(A) K4.11
NetD30_2: D30.2(A) K1.A2 Q8.1(C) R49.2
NetD31_2: D31.2(A) K4.A2 Q9.1(C) R50.2
NetD32_2: D32.2(A) K3.A2 Q10.1(C) R51.2
NetD33_2: D33.2(A) K2.A2 Q11.1(C) R52.2
NetD34_2: D34.2(A) K5.A2 Q12.1(C) R53.2
NetD35_1: K2.11 ; port ALT_F
NetD37_1: K2.21 ; port ALT_N
NetDS3_1: DS3.1(A) K1.11 K1.12 K1.21 K1.22 R33.2
NetDS3_2: DS3.2(K) R34.1
NetDS4_2: DS4.2(K) R39.1
NetDS5_2: DS5.2(K) R49.1
NetDS6_2: DS6.2(K) R50.1
NetDS7_2: DS7.2(K) R51.1
NetDS8_2: DS8.2(K) R52.1
NetDS9_2: DS9.2(K) R53.1
NetJ4_1: K1.14 K1.24 K3.14 K3.24 ; port BAT+
NetJ4_3: K5.14 K5.24 ; port BAT-
NetQ8_2: Q8.2(B) R35.1
NetQ9_2: Q9.2(B) R37.1
NetQ10_2: Q10.2(B) R40.1
NetQ11_2: Q11.2(B) R42.1
NetQ12_2: Q12.2(B) R43.1
NetR32_2: R32.2 R33.1
NetR35_2: R35.2 R36.2 ; port Pre-Charge
NetR37_2: R37.2 R38.2 ; port NO_BAT_PWR
NetR40_2: R40.2 R41.2 ; port CNTR+
NetR42_2: R42.2 R44.2 ; port Mains_Relay
NetR43_2: R43.2 R45.2 ; port CNTR-

Not connected (* = marked no-connect by the designer): K2 12(7) 22(2); K4 12(7) 21(3) 22(2) 24(4)

### Library data of the parts
D28 D29 = Normal Diode: MF: NTE Electronics, Inc.; Package: DO-41 NTE Electronics; Check_prices: https://www.snapeda.com/parts/1N4007/NTE+Electronics/view-part/?ref=eda; Value: *; Purchase-URL: https://pricing.snapeda.com/search/part/1N4007/?ref=eda; Availability: In Stock; SnapEDA_Link: https://www.snapeda.com/parts/1N4007/NTE+Electronics/view-part/?ref=snap; MP: 1N4007; Price: None
D30-D34 = Normal Diode: MF: NTE Electronics, Inc.; MP: 1N4007; Package: DO-41 NTE Electronics; Check_prices: https://www.snapeda.com/parts/1N4007/NTE+Electronics/view-part/?ref=eda; Value: *; Purchase-URL: https://pricing.snapeda.com/search/part/1N4007/?ref=eda; Availability: In Stock; SnapEDA_Link: https://www.snapeda.com/parts/1N4007/NTE+Electronics/view-part/?ref=snap; Price: None
DS3-DS9 = RED_LED 3mm: Radial LED, 12.6 mcd, 20 mA, 2 V, -55 to 100 degC, 2-Pin THD, RoHS, Bulk; Shielding: Unshielded; Resistance: 0.045 Ohm; Current Rating: 3.6 A; Tolerance: 20%; PackageReference: LTL-1CHE; PackageDescription: 2-Pin Through Hole Device, Dia 3.8 mm, Pitch 2.54 mm; Case\Package: Radial; Length: 0.97 inch; Width: 0.62 inch; Height: 1.1 inch; Radiation Hardening: No; Lead Pitch: 11.44 mm; ComponentLink1URL: http://www.us.liteon.com/; ComponentLink1Description: Manufacturer URL; RoHSCompliant: true; Packaging: Tray; Mount: Through Hole; Min Operating Temperature: -40 degC; Max Operating Temperature: 130 degC; ComponentLink2URL: https://datasheet.ciiva.com/15117/getdatasheetpartid-187746-15117985.pdf; Package Quantity: 55; ComponentLink2Description: Datasheet; DatasheetVersion: Dec-03
K1-K5 = relay 8pin: General Purpose Relay DPDT _2 Form C_ 24VDC Coil Through Hole; MF: TE Connectivity; MP: 1-1393243-0; Package: None; Value: *; Availability: Unavailable; SnapEDA_Link: https://www.snapeda.com/parts/1-1393243-0/TE%20Connectivity%20Potter%20&%20Brumfield%20Relays/view-part/244556/?ref=snap; Price: None
Q8-Q12 = BC548: Bipolar (BJT) Transistor NPN 30V 100mA 300MHz 500mW Through Hole TO-92-3; MF: ON Semiconductor; DigiKey-Purchase-URL: https://snapeda.com/shop?store=DigiKey&id=2007035; MP: BC548; Availability: Warning; Package: TO-92 ON Semiconductor; Value: *; SnapEDA_Link: https://www.snapeda.com/parts/BC548/ON%20Semiconductor/view-part/2007035/?ref=snap; Price: None
R32 R33 = Resistor: as R1 on sheet IR2110; Price: None; Availability: In Stock; EU_RoHS_Compliance: Compliant with Exemptions; Package: 0805; Value: *; SnapEDA_Link: https://www.snapeda.com/parts/2-2176053-0/TE+Connectivity/view-part/?ref=snap; Check_prices: https://www.snapeda.com/parts/2-2176053-0/TE+Connectivity/view-part/?ref=eda
R34-R45 R49-R53 = Resistor_Through Hole: as R6 on sheet Bi_Dir_Circuit; Availability: Warning; Value: *; Check_prices: https://www.snapeda.com/parts/MFR-25FTE52-1R/Yageo/view-part/4629919/?ref=eda; Package: Axial Yageo; Price: None; SnapEDA_Link: https://www.snapeda.com/parts/MFR-25FTE52-1R/Yageo/view-part/4629919/?ref=snap; Purchase-URL: https://pricing.snapeda.com/search/part/MFR-25FTE52-1R/?ref=eda

## Sheet Communication.SchDoc
size A4; SheetNumber: 5; SheetTotal: 7
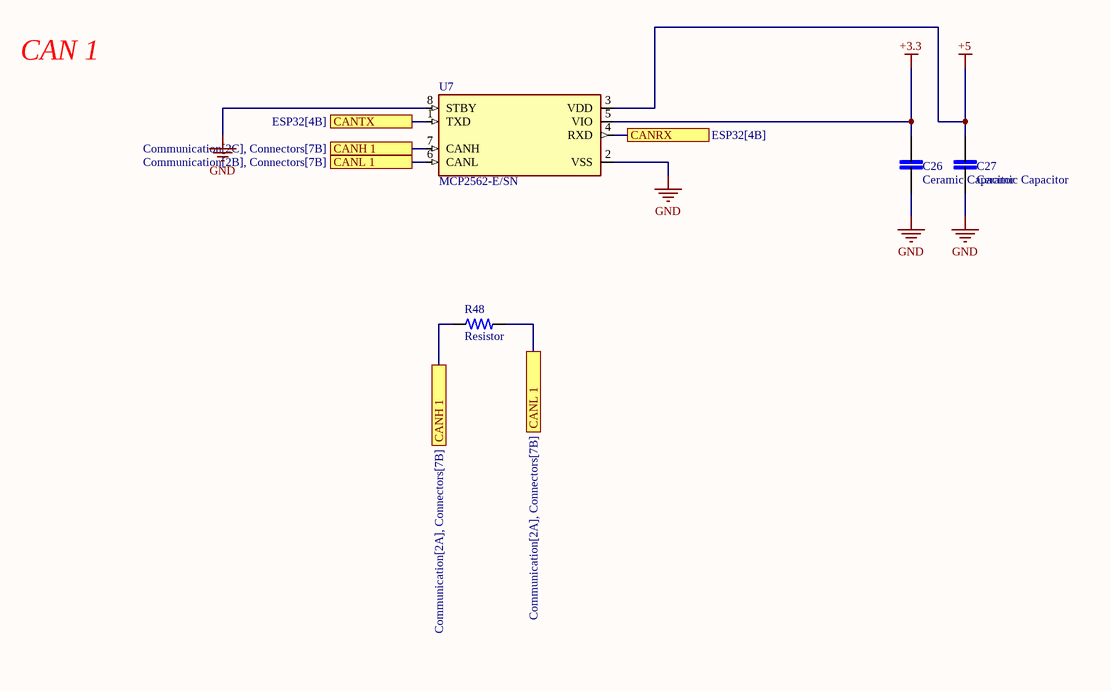
[diagram p5: Communication.SchDoc]

### Parts
C26  Ceramic Capacitor  [Ceramic Capacitor]
C27  Ceramic Capacitor  [Ceramic Capacitor]
R48  Resistor  [Resistor_Through Hole]
U7  MCP2562-E/SN  [MCP2562-E/SN]

### Ports
CANH 1 (see Communication[2A], Connectors[7B]), CANH 1 (see Communication[2C], Connectors[7B]), CANL 1 (see Communication[2A], Connectors[7B]), CANL 1 (see Communication[2B], Connectors[7B]), CANRX (see ESP32[4B]), CANTX (see ESP32[4B])

### Nets
+3.3: C26.2 U7.5(VIO)
+5: C27.2 U7.3(VDD)
GND: C26.1 C27.1 U7.2(VSS) U7.8(STBY)
NetJ5_1: R48.1 U7.7(CANH) ; port CANH 1
NetJ5_2: R48.2 U7.6(CANL) ; port CANL 1
NetU1_27: U7.4(RXD) ; port CANRX
NetU1_28: U7.1(TXD) ; port CANTX

### Notes on the sheet
- CAN 1

### Library data of the parts
C26 C27 = Ceramic Capacitor: MP: LD051A121KAB2A; MF: AVX; SnapEDA_Link: https://www.snapeda.com/parts/LD051A121KAB2A/AVX/view-part/?ref=snap; Package: 0805 AVX; Check_prices: https://www.snapeda.com/parts/LD051A121KAB2A/AVX/view-part/?ref=eda; Purchase-URL: https://pricing.snapeda.com/search/part/LD051A121KAB2A/?ref=eda; Price: None; Value: *; Availability: In Stock
R48 = Resistor: as R1 on sheet IR2110; Price: None; Availability: In Stock; EU_RoHS_Compliance: Compliant with Exemptions; Package: 0805; Value: *; SnapEDA_Link: https://www.snapeda.com/parts/2-2176053-0/TE+Connectivity/view-part/?ref=snap; Check_prices: https://www.snapeda.com/parts/2-2176053-0/TE+Connectivity/view-part/?ref=eda
U7 = MCP2562-E/SN: 1/1 Transceiver Half CANbus 8-SOIC; MF: Microchip; Value: *; Availability: Unavailable; Package: SO-8 Microchip; Price: None; SnapEDA_Link: https://www.snapeda.com/parts/MCP2562-E/SN/Microchip/view-part/1055306/?ref=snap; MP: MCP2562-E/SN

## Sheet Zero-Cross_Detection.SchDoc
size A4; SheetNumber: 7; SheetTotal: 7
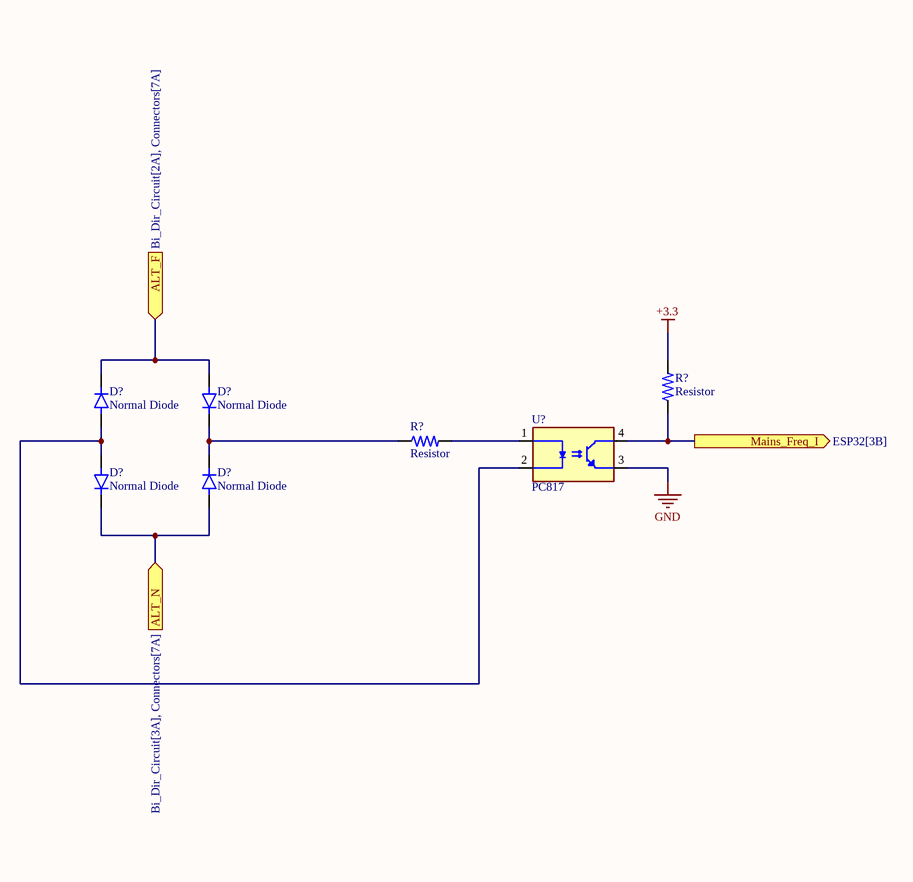
[diagram p6: Zero-Cross_Detection.SchDoc]

### Parts
D35  Normal Diode  [Common Trhough Hole]
D36  Normal Diode  [Common Trhough Hole]
D37  Normal Diode  [Common Trhough Hole]
D38  Normal Diode  [Common Trhough Hole]
R46  Resistor  [Resistor_Through Hole]
R47  Resistor  [Resistor_Through Hole]
U8  PC817  [PC817]

### Ports
ALT_F (in, see Bi_Dir_Circuit[2A], Connectors[7A]), ALT_N (in, see Bi_Dir_Circuit[3A], Connectors[7A]), Mains_Freq_I (out, see ESP32[3B])

### Nets
+3.3: R46.2
GND: U8.3(EMITTER)
NetD35_1: D35.1(K) D36.2(A) ; port ALT_F
NetD35_2: D35.2(A) D37.2(A) U8.2(CATHODE)
NetD36_1: D36.1(K) D38.1(K) R47.1
NetD37_1: D37.1(K) D38.2(A) ; port ALT_N
NetR46_1: R46.1 U8.4(COLLECTOR) ; port Mains_Freq_I
NetR47_2: R47.2 U8.1(ANODE)

### Library data of the parts
D35-D38 = Normal Diode: MF: NTE Electronics, Inc.; MP: 1N4007
R46 R47 = Resistor: as R1 on sheet IR2110
U8 = PC817: Optoisolator Transistor Output - 1 Channel 4-DIP; MP: PC817X3NSZ1B; MF: Sharp Microelectronics

## Sheet Connectors.SchDoc
size A3; SheetNumber: 7; SheetTotal: 7
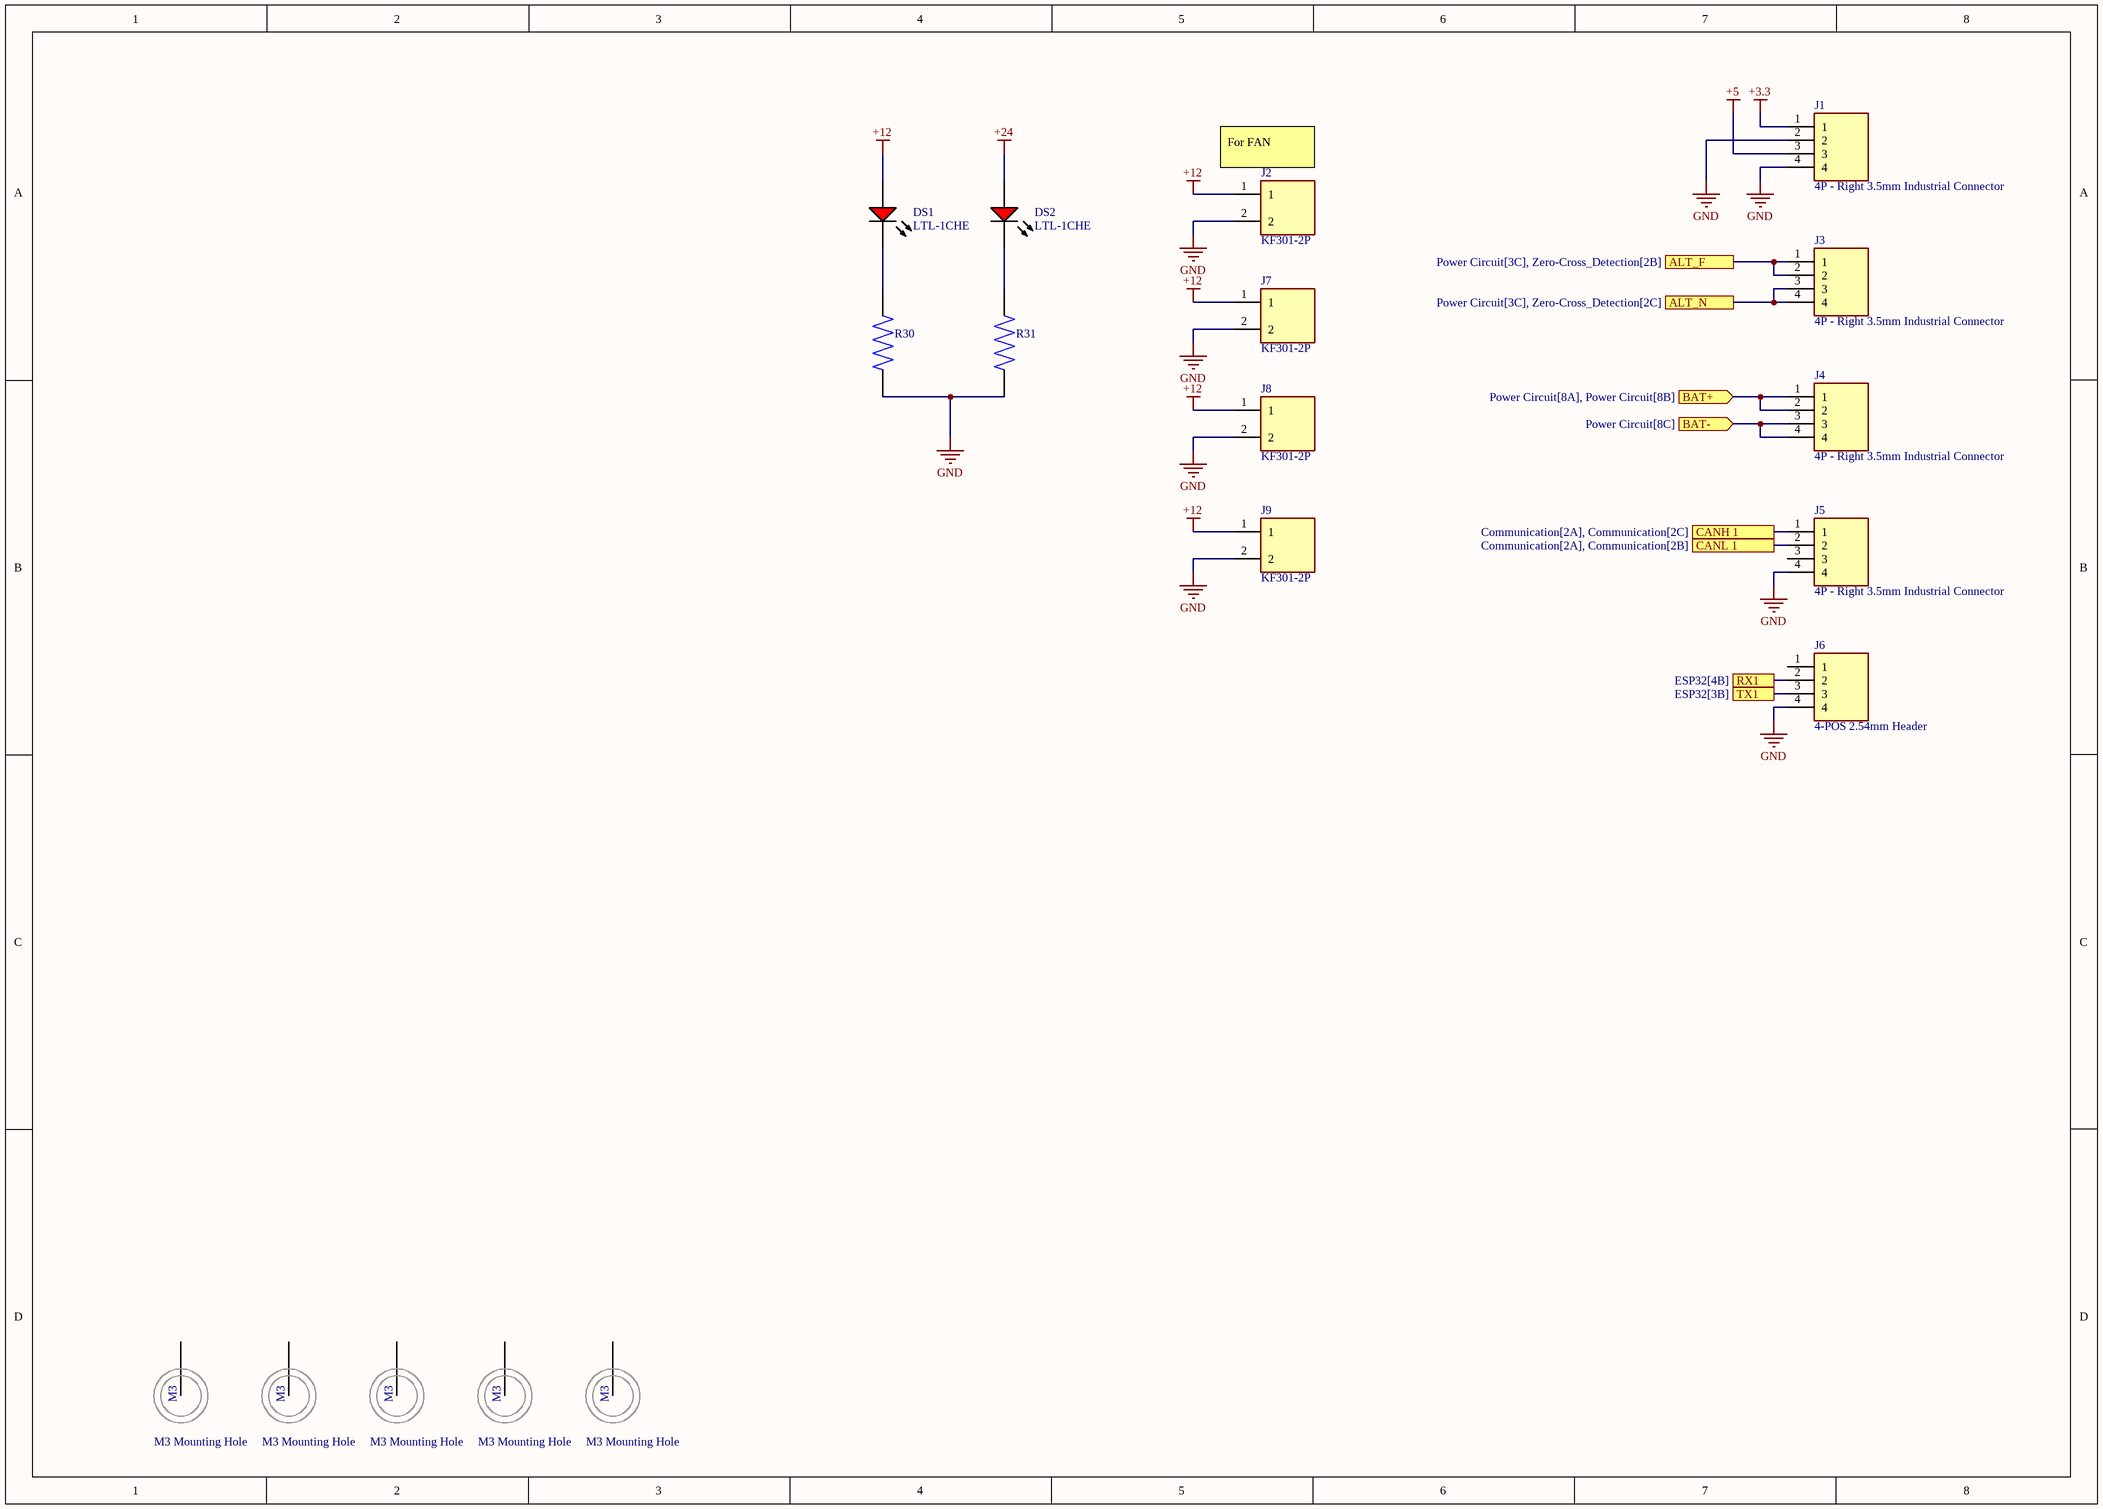
[diagram p7: Connectors.SchDoc]

### Parts
(Parts that share a designator on the sheet are numbered #1, #2 ... from top to bottom, then left to right.)
#1  M3 Mounting Hole  [M3 - Mounting Hole]
#2  M3 Mounting Hole  [M3 - Mounting Hole]
#3  M3 Mounting Hole  [M3 - Mounting Hole]
#4  M3 Mounting Hole  [M3 - Mounting Hole]
#5  M3 Mounting Hole  [M3 - Mounting Hole]
DS1  LTL-1CHE  [LED3mm]
DS2  LTL-1CHE  [LED3mm]
J1  4P - Right 3.5mm Industrial Connector  [4P - Right 3.5mm Industrial Connector]
J2  KF301-2P  [KF301-2P]
J3  4P - Right 3.5mm Industrial Connector  [4P - Right 3.5mm Industrial Connector]
J4  4P - Right 3.5mm Industrial Connector  [4P - Right 3.5mm Industrial Connector]
J5  4P - Right 3.5mm Industrial Connector  [4P - Right 3.5mm Industrial Connector]
J6  4-POS 2.54mm Header  [4-POS 2.54mm Header]
J7  KF301-2P  [KF301-2P]
J8  KF301-2P  [KF301-2P]
J9  KF301-2P  [KF301-2P]
R30  Resistor_Through Hole  [Resistor_Through Hole]  (value not drawn)
R31  Resistor_Through Hole  [Resistor_Through Hole]  (value not drawn)

### Ports
ALT_F (see Power Circuit[3C], Zero-Cross_Detection[2B]), ALT_N (see Power Circuit[3C], Zero-Cross_Detection[2C]), BAT+ (in, see Power Circuit[8A], Power Circuit[8B]), BAT- (in, see Power Circuit[8C]), CANH 1 (see Communication[2A], Communication[2C]), CANL 1 (see Communication[2A], Communication[2B]), RX1 (see ESP32[4B]), TX1 (see ESP32[3B])

### Nets
+3.3: J1.1
+5: J1.3
+12: DS1.1(A) J2.1 J7.1 J8.1 J9.1
+24: DS2.1(A)
GND: J1.2 J1.4 J2.2 J5.4 J6.4 J7.2 J8.2 J9.2 R30.2 R31.2
NetD35_1: J3.1 J3.2 ; port ALT_F
NetD37_1: J3.3 J3.4 ; port ALT_N
NetDS1_2: DS1.2(K) R30.1
NetDS2_2: DS2.2(K) R31.1
NetJ4_1: J4.1 J4.2 ; port BAT+
NetJ4_3: J4.3 J4.4 ; port BAT-
NetJ5_1: J5.1 ; port CANH 1
NetJ5_2: J5.2 ; port CANL 1
NetJ6_2: J6.2 ; port RX1
NetJ6_3: J6.3 ; port TX1

Not connected (* = marked no-connect by the designer): #1 1(M3); #2 1(M3); #3 1(M3); #4 1(M3); #5 1(M3); J5 3; J6 1

### Notes on the sheet
- (near J2) For FAN

### Library data of the parts
DS1 DS2 = RED_LED 3mm: as DS3 on sheet Power Circuit; PackageReference: LTL-1CHE; PackageDescription: 2-Pin Through Hole Device, Dia 3.8 mm, Pitch 2.54 mm; Case\Package: Radial; Length: 0.97 inch; Width: 0.62 inch; Height: 1.1 inch; Radiation Hardening: No; Lead Pitch: 11.44 mm; ComponentLink1URL: http://www.us.liteon.com/; ComponentLink1Description: Manufacturer URL; RoHSCompliant: true; Packaging: Tray; Mount: Through Hole; Min Operating Temperature: -40 degC; Max Operating Temperature: 130 degC; ComponentLink2URL: https://datasheet.ciiva.com/15117/getdatasheetpartid-187746-15117985.pdf; Package Quantity: 55; ComponentLink2Description: Datasheet; DatasheetVersion: Dec-03
J1 J3-J5 = 4P - Right 3.5mm Industrial Connector: MP: 5-146290-4; Package: None; Price: None; Value: *; Availability: Unavailable
J2 J7-J9 = KF301-2P: 2 Pin Terminal Block 5mm Pitch; Price: None; Value: *; MP: KF301-2P; Package: None; Availability: Unavailable
J6 = 4-POS 2.54mm Header: MP: 5-146290-4; Package: None; Price: None; Value: *; Availability: Unavailable
R30 R31 = Resistor_Through Hole: as R6 on sheet Bi_Dir_Circuit; Availability: Warning; Value: *; Check_prices: https://www.snapeda.com/parts/MFR-25FTE52-1R/Yageo/view-part/4629919/?ref=eda; Package: Axial Yageo; Price: None; SnapEDA_Link: https://www.snapeda.com/parts/MFR-25FTE52-1R/Yageo/view-part/4629919/?ref=snap; Purchase-URL: https://pricing.snapeda.com/search/part/MFR-25FTE52-1R/?ref=eda

## Nets that join several sheets
+3.3: ESP32 (U1.1), IR2110 (6 pins), Communication (C26.2 U7.5), Zero-Cross_Detection (R46.2), Connectors (J1.1)
+5: ESP32 (C1.2 D1.1 PS1.3), Bi_Dir_Circuit (U5.8 U6.8), Communication (C27.2 U7.3), Connectors (J1.3)
+12: IR2110 (D4.2), Bi_Dir_Circuit (R25.2 U6.3 U6.4), Power Circuit (7 pins), Connectors (5 pins)
+24: ESP32 (C2.2 PS1.1), IR2110 (5 pins), Bi_Dir_Circuit (13 pins), Power Circuit (10 pins), Connectors (DS2.1)
GND: ESP32 (6 pins), IR2110 (16 pins), Bi_Dir_Circuit (26 pins), Power Circuit (16 pins), Communication (C26.1 C27.1 U7.2 U7.8), Zero-Cross_Detection (U8.3), Connectors (10 pins)
NetC7_1: IR2110 (C7.1 D5.2 U2.5), Bi_Dir_Circuit (9 pins)
NetC9_1: IR2110 (C9.1 D7.2 U3.5), Bi_Dir_Circuit (8 pins), Power Circuit (K2.14)
NetC11_1: IR2110 (C11.1 D9.2 U4.5), Bi_Dir_Circuit (8 pins), Power Circuit (K2.24)
NetC18_P: ESP32 (U1.26), Bi_Dir_Circuit (C18.P R16.2 R17.2)
NetC20_P: ESP32 (U1.6), Bi_Dir_Circuit (C20.P R18.1 R19.2)
NetC24_P: ESP32 (U1.23), Bi_Dir_Circuit (C24.P R25.1 R27.2)
NetC25_P: ESP32 (U1.12), Bi_Dir_Circuit (C25.P)
NetD14_C: IR2110 (U3.7), Bi_Dir_Circuit (D14.C R6.1 R8.1)
NetD15_C: IR2110 (U4.7), Bi_Dir_Circuit (D15.C R7.1 R9.1)
NetD17_C: IR2110 (U3.1), Bi_Dir_Circuit (D17.C R12.1 R14.1)
NetD18_C: IR2110 (U4.1), Bi_Dir_Circuit (D18.C R13.1 R15.1)
NetD24_C: IR2110 (U2.1), Bi_Dir_Circuit (D24.C R21.1 R22.1)
NetD25_C: IR2110 (U2.7), Bi_Dir_Circuit (D25.C R24.1 R26.1)
NetD35_1: Power Circuit (K2.11), Zero-Cross_Detection (D35.1 D36.2), Connectors (J3.1 J3.2)
NetD37_1: Power Circuit (K2.21), Zero-Cross_Detection (D37.1 D38.2), Connectors (J3.3 J3.4)
NetJ4_1: Power Circuit (K1.14 K1.24 K3.14 K3.24), Connectors (J4.1 J4.2)
NetJ4_3: Power Circuit (K5.14 K5.24), Connectors (J4.3 J4.4)
NetJ5_1: Communication (R48.1 U7.7), Connectors (J5.1)
NetJ5_2: Communication (R48.2 U7.6), Connectors (J5.2)
NetJ6_2: ESP32 (U1.30), Connectors (J6.2)
NetJ6_3: ESP32 (U1.15), Connectors (J6.3)
NetR35_2: ESP32 (U1.7), Power Circuit (R35.2 R36.2)
NetR37_2: ESP32 (U1.11), Power Circuit (R37.2 R38.2)
NetR40_2: ESP32 (U1.8), Power Circuit (R40.2 R41.2)
NetR42_2: ESP32 (U1.10), Power Circuit (R42.2 R44.2)
NetR43_2: ESP32 (U1.9), Power Circuit (R43.2 R45.2)
NetR46_1: ESP32 (U1.5), Zero-Cross_Detection (R46.1 U8.4)
NetU1_27: ESP32 (U1.27), Communication (U7.4)
NetU1_28: ESP32 (U1.28), Communication (U7.1)
NetU1_31: ESP32 (U1.31), IR2110 (U3.12 U4.10)
NetU1_33: ESP32 (U1.33), IR2110 (U3.10 U4.12)
NetU1_36: ESP32 (U1.36), IR2110 (U2.10)
NetU1_37: ESP32 (U1.37), IR2110 (U2.12)